# Altium schematic sheet CANTRICK MCU.SchDoc
size A4; SheetNumber: 4; SheetTotal: 5
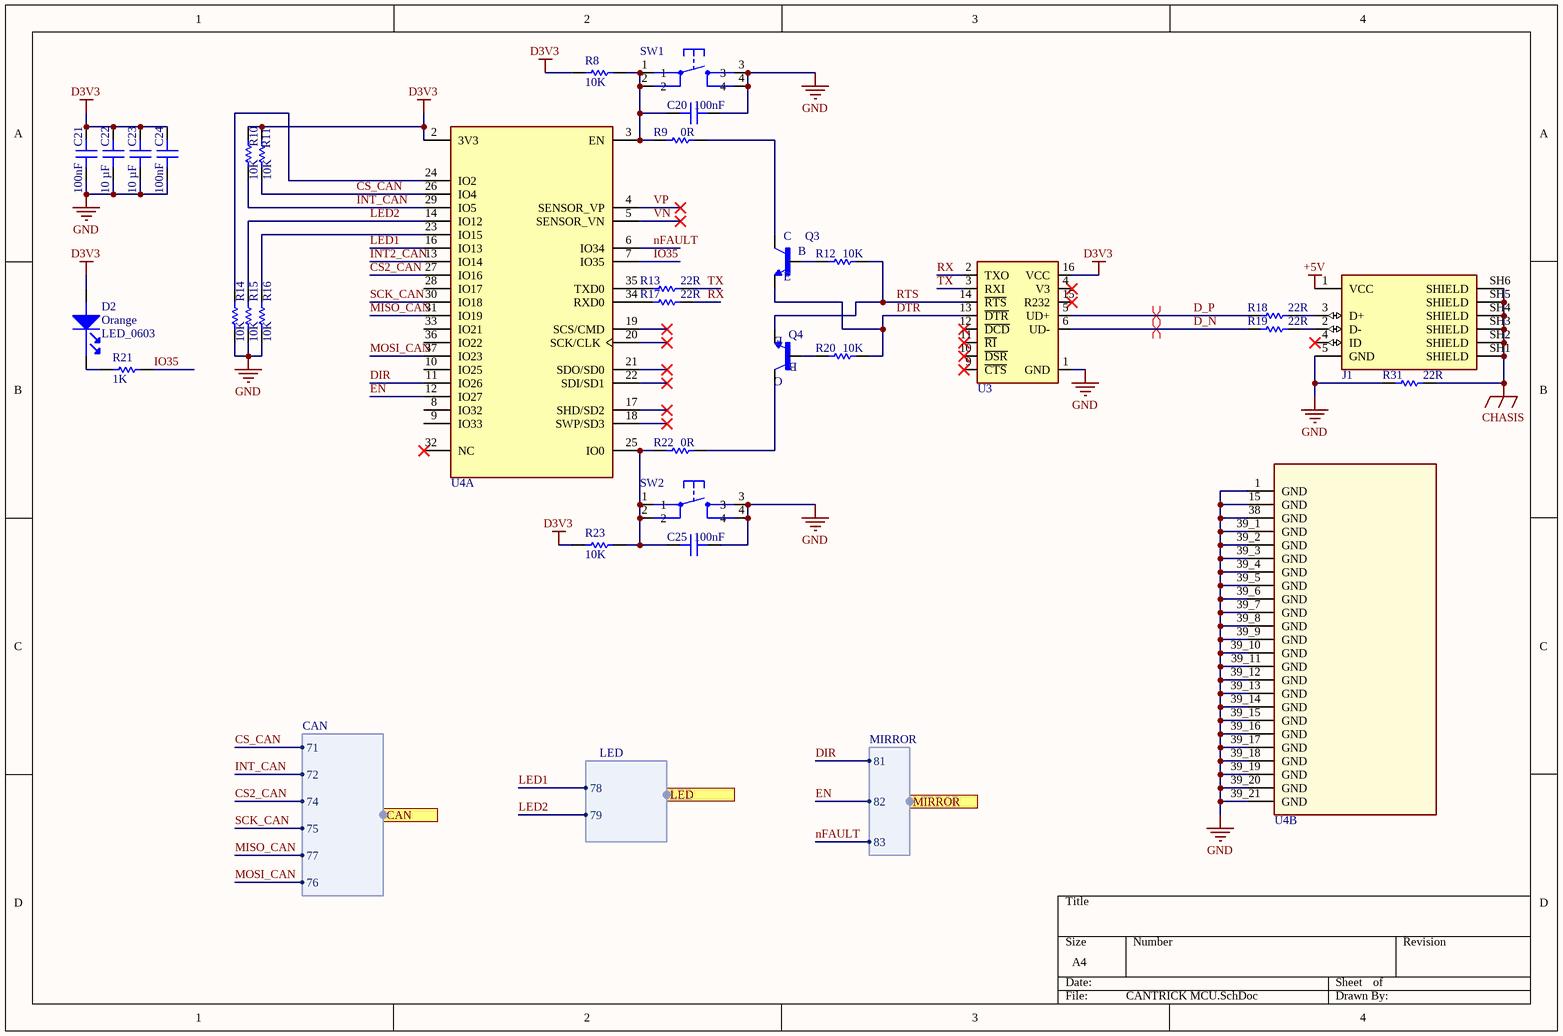
[diagram p0: CANTRICK MCU.SchDoc]

## Parts
C20  100nF  [CAP 0603]
C21  100nF  [CAP 0603]
C22  10 µF  [CAP 0603]
C23  10 µF  [CAP 0603]
C24  100nF  [CAP 0603]
C25  100nF  [CAP 0603]
D2  Orange  Package / Case: LED_0603  [LED]
J1  MICRO B  [MICRO USB B]  (value not drawn)
Q3  NMOS  [SOT23-3]  (value not drawn)
Q4  NMOS  [SOT23-3]  (value not drawn)
R8  10K  [Res 0603]
R9  0R  [Res 0603]
R10  10K  [Res 0603]
R11  10K  [Res 0603]
R12  10K  [Res 0603]
R13  22R  [Res 0603]
R14  10K  [Res 0603]
R15  10K  [Res 0603]
R16  10K  [Res 0603]
R17  22R  [Res 0603]
R18  22R  [Res 0603]
R19  22R  [Res 0603]
R20  10K  [Res 0603]
R21  1K  [Res 0603]
R22  0R  [Res 0603]
R23  10K  [Res 0603]
R31  22R  [Res 0603]
SW1  SW2  [SWITCH]  (value not drawn)
SW2  SW2  [SWITCH]  (value not drawn)
U3  CH340C  [CH340C]  (value not drawn)
U4  ESP32-WROOM-32UE-N8  [ESP32S]  (value not drawn)  (parts A,B of 2)

## Ports
CAN (harness CAN), LED (harness LED), MIRROR (harness MIRROR)

## Harnesses
CAN: 71, 72, 74, 75, 76, 77
LED: 78, 79
MIRROR: 81, 82, 83

## Nets
+5V: J1.1(VCC)
CHASIS: J1.SH1(SHIELD) J1.SH2(SHIELD) J1.SH3(SHIELD) J1.SH4(SHIELD) J1.SH5(SHIELD) J1.SH6(SHIELD) R31.2
D3V3: C21.2 C22.2 C23.2 C24.2 D2.1(ANODE) R8.1 R10.2 R11.2 R23.1 U3.16(VCC) U4.2(3V3)
GND: C20.1 C21.1 C22.1 C23.1 C24.1 C25.1 J1.5(GND) R14.1 R15.1 R16.1 R31.1 SW1.3 SW1.4 SW2.3 SW2.4 U3.1(GND) U4.1(GND) U4.15(GND) U4.38(GND) U4.39_1(GND) U4.39_2(GND) U4.39_3(GND) U4.39_4(GND) U4.39_5(GND) U4.39_6(GND) U4.39_7(GND) U4.39_8(GND) U4.39_9(GND) U4.39_10(GND) U4.39_11(GND) U4.39_12(GND) U4.39_13(GND) U4.39_14(GND) U4.39_15(GND) U4.39_16(GND) U4.39_17(GND) U4.39_18(GND) U4.39_19(GND) U4.39_20(GND) U4.39_21(GND)
CS2_CAN: U4.27(IO16) ; port CAN.74
CS_CAN: R11.1 U4.26(IO4) ; port CAN.71
D_N: R19.1 U3.6(UD-)
D_P: R18.1 U3.5(UD+)
DIR: U4.11(IO26) ; port MIRROR.81
DTR: Q3.2(E) R20.2 U3.13(~{DTR})
EN: U4.12(IO27) ; port MIRROR.82
INT2_CAN: U4.13(IO14)
INT_CAN: R10.1 U4.29(IO5) ; port CAN.72
IO35: R21.2 U4.7(IO35)
LED1: U4.16(IO13) ; port LED.78
LED2: R15.2 U4.14(IO12) ; port LED.79
MISO_CAN: U4.31(IO19) ; port CAN.77
MOSI_CAN: U4.37(IO23) ; port CAN.76
nFAULT: U4.6(IO34) ; port MIRROR.83
RTS: Q4.2(E) R12.2 U3.14(~{RTS})
RX: R17.2 U3.2(TXO)
SCK_CAN: U4.30(IO18) ; port CAN.75
TX: R13.2 U3.3(RXI)
VN: U4.5(SENSOR_VN)
VP: U4.4(SENSOR_VP)
NetC20_2: C20.2 R8.2 R9.1 SW1.1 SW1.2 U4.3(EN)
NetC25_2: C25.2 R22.1 R23.2 SW2.1 SW2.2 U4.25(IO0)
NetD2_2: D2.2(cathode) R21.1
NetJ1_2: J1.2(D-) R19.2
NetJ1_3: J1.3(D+) R18.2
NetQ3_1: Q3.1(B) R12.1
NetQ3_3: Q3.3(C) R9.2
NetQ4_1: Q4.1(B) R20.1
NetQ4_3: Q4.3(C) R22.2
NetR13_1: R13.1 U4.35(TXD0)
NetR14_2: R14.2 U4.24(IO2)
NetR16_2: R16.2 U4.23(IO15)
NetR17_1: R17.1 U4.34(RXD0)

Not connected (* = marked no-connect by the designer): J1 4(ID)*; U3 4(V3)* 9(~{CTS})* 10(~{DSR})* 11(~{RI})* 12(~{DCD})* 15(R232)*; U4 8(IO32) 9(IO33) 10(IO25) 17(SHD/SD2)* 18(SWP/SD3)* 19(SCS/CMD)* 20(SCK/CLK)* 21(SDO/SD0)* 22(SDI/SD1)* 28(IO17) 32(NC)* 33(IO21) 36(IO22)

## Layout directives
differential pair: D_N, D_P

## Library data of the parts
C20 C21 C24 C25 = GMC10X7R106K10NT: CAP0603 X7R 10UF 10% 10V; manufacturer: Cal-Chip Electronics, Inc.; Capacitance: 10 µF; Part Number: GMC10X7R106K10NT; Value: 100nF; Applications: General Purpose; componentlink1description: Datasheet; componentlink1url: https://88ce57.p3cdn1.secureserver.net/wp-content/uploads/2023/01/gmc_series-2.pdf; componentlink2description: DigiKey Link; componentlink2url: https://www.digikey.com/en/products/detail/cal-chip-electronics-inc/GMC10X7R106K10NT/18151126; Device Package: 0603 (1608 Metric); lastupdated: 2/9/2024 8:09:39 PM; Lifecycle Status: Active; Minimum Order: 1; Mounting Type: Surface Mount, MLCC; Operating Temperature: -55°C ~ 125°C; Package / Case: 0603 (1608 Metric); packaging: TapeAndReel; partid: 49835; Part Status: Active; price: 0.26; series: GMC; Size / Dimension: 0.063" L x 0.031" W (1.60mm x 0.80mm); Supplier 1: DigiKey; Supplier Part Number 1: 4713-GMC10X7R106K10NTCT-ND; Temperature Coefficient: X7R; Thickness (Max): 0.039" (1.00mm); Tolerance: ±10%; Voltage - Rated: 10V
C22 C23 = GMC10X7R106K10NT: CAP0603 X7R 10UF 10% 10V; manufacturer: Cal-Chip Electronics, Inc.; Part Number: GMC10X7R106K10NT; Value: 10 µF; Applications: General Purpose; Capacitance: 10 µF; componentlink1description: Datasheet; componentlink1url: https://88ce57.p3cdn1.secureserver.net/wp-content/uploads/2023/01/gmc_series-2.pdf; componentlink2description: DigiKey Link; componentlink2url: https://www.digikey.com/en/products/detail/cal-chip-electronics-inc/GMC10X7R106K10NT/18151126; Device Package: 0603 (1608 Metric); lastupdated: 2/9/2024 8:09:39 PM; Lifecycle Status: Active; Minimum Order: 1; Mounting Type: Surface Mount, MLCC; Operating Temperature: -55°C ~ 125°C; Package / Case: 0603 (1608 Metric); packaging: TapeAndReel; partid: 49835; Part Status: Active; price: 0.26; series: GMC; Size / Dimension: 0.063" L x 0.031" W (1.60mm x 0.80mm); Supplier 1: DigiKey; Supplier Part Number 1: 4713-GMC10X7R106K10NTCT-ND; Temperature Coefficient: X7R; Thickness (Max): 0.039" (1.00mm); Tolerance: ±10%; Voltage - Rated: 10V
D2 = LED ORANGE 606NM 0603: LED SMARTLED ORANGE 606NM 0603; Manufacturer: OSRAM Opto Semiconductors Inc; Manufacturer Part Number: LO L29K-H2K1-24-Z; Millicandela Rating: 6.3mcd; Voltage - Forward (Vf) Typ: 1.8V; Current - Test: 2mA; Wavelength - Peak: 610nm; Viewing Angle: 160°; Lens Type: Diffused; Lens Style/Size: Rectangle with Flat Top, 1.3mm x 0.8mm; Luminous Flux @ Current - Test: 25 mlm; By: Hieu.Nguyen_20191030; Supplier 1: Digi-Key; Supplier Part Number 1: 475-2740-1-ND; RoHS: RoHS Compliant; Category: Optoelectronics; Stock 1: 15900; Pricing 1: 1=0.17, 10=0.141, 100=0.1127, 250=0.0986, 500=0.09016 (USD); Color: Orange; Wavelength - Dominant: 606nm; Size / Dimension: 1.70mm L x 0.80mm W; Height: 0.65mm; Mounting Type: Surface Mount; Packaging: Cut Tape (CT); ComponentLink1URL: http://catalog.osram-os.com/catalogue/catalogue.do;jsessionid=302CF83AF637AE24E40AEB0ADA267EDD?act=downloadFile&favOid=020000010003f9de000100b6; ComponentLink1Description: http://catalog.osram-os.com/catalogue/catalogue.do;jsessionid=302CF83AF637AE24E40AEB0ADA267EDD?act=downloadFile&favOid=020000010003f9de000100b6
J1 = MICRO USB B
Q3 Q4 = MMBT3904: MMBT3904 Series 40 V CE Breakdown 0.2 A NPN General Purpose Amplifier - SOT-23; Manufacturer: onsemi; Collector Emitter Voltage (VCEO): 40V; hFE Min: 100; Max Power Dissipation: 350mW; Max Collector Current: 200mA; Transition Frequency: 300MHz; Collector Base Voltage (VCBO): 60V; Emitter Base Voltage (VEBO): 6V; Collector Emitter Saturation Voltage: 300mV; Supplier 1: Farnell; Manufacturer Part Number: MMBT3904; RoHS: Yes; Category: BJTs; Pricing 1: 5=0,136, 25=0,133, 100=0,0476, 250=0,0435, 500=0,043, 1000=0,022, 5000=0,02 (GBP); Mount: Surface Mount; Case/Package: SOT-23; Number of Pins: 3; Weight: 0.03g; Min Operating Temperature: -55°C; Max Operating Temperature: 150°C; Packaging: Tape and Reel; Polarity: NPN; Collector Emitter Breakdown Voltage: 40V; Voltage Rating (DC): 40V; Package Quantity: 1; Max Breakdown Voltage: 40V; Current Rating: 200mA; Series: -; Collector-emitter Voltage-Max: 300mV; Termination: SMD/SMT; Radiation Hardening: No; RoHS Compliant: Yes; Reach SVHC Compliant: No; Lead Free: Lead Free; Supplier Part Number 1: 9846727
R8-R23 R31 = Resistor 2.2K: Res Thick Film 0603 2.2K Ohm 5% 1/10W ±200ppm/°C Molded SMD SMD Paper T/R; Manufacturer: Vishay; Manufacturer Part Number: CRCW06032K20JNEA; Resistance: 2.2kR; Power Rating: 100mW; Voltage Rating: 75V; Supplier 1: Arrow Electronics; RoHS: Yes; Category: Chip SMD Resistors; Stock 1: 130000; Pricing 1: 5000=0.0053 (USD); Case/Package: 0603; Weight: 7.1E-05oz; Case Code (Metric): 1608; Case Code (Imperial): 0603; Contact Plating: Tin; Size Code: 0603; Min Operating Temperature: -55°C; Max Operating Temperature: 155°C; Package Quantity: 5000; Tolerance: 5%; Packaging: Tape and Reel; Resistor Type: Thick Film; Number of Terminations: 2; Temperature Coefficient: 200ppm/°C; Termination: SMD/SMT; Max Power Dissipation: 100mW; Features: Automotive AEC-Q200; Series: CRCW; Resistance Tolerance: 5%; Construction: Rectangular; Length: 1.55mm; Width: 0.85mm; Height: 0.45mm; Depth: 0.85mm; Ratings: AEC-Q200; Radiation Hardening: No; Military Standard: Not; RoHS Compliant: Yes; Reach SVHC Compliant: Unknown; Lead Free: 5697LeadFree; ComponentLink1URL: https://datasheet.ciiva.com/2462/dcrcwe3-2462048.pdf?src-supplier=Digikey; ComponentLink1Description: https://datasheet.ciiva.com/2462/dcrcwe3-2462048.pdf?src-supplier=Digikey; ComponentLink2URL: https://datasheet.ciiva.com/16767/70201119-16767464.pdf?src-supplier=Allied+Electronics; ComponentLink2Description: https://datasheet.ciiva.com/16767/70201119-16767464.pdf?src-supplier=Allied+Electronics; ComponentLink3URL: https://datasheet.ciiva.com/2462/dcrcwe3-2462046.pdf?src-supplier=Digikey; ComponentLink3Description: https://datasheet.ciiva.com/2462/dcrcwe3-2462046.pdf?src-supplier=Digikey; ComponentLink4URL: https://datasheet.ciiva.com/5541/dcrcwe3-109170-5541959.pdf?src-supplier=Mouser; ComponentLink4Description: https://datasheet.ciiva.com/5541/dcrcwe3-109170-5541959.pdf?src-supplier=Mouser; ComponentLink5URL: https://datasheet.ciiva.com/16286/dcrcwe3-16286997.pdf?src-supplier=Future+Electronics; ComponentLink5Description: https://datasheet.ciiva.com/16286/dcrcwe3-16286997.pdf?src-supplier=Future+Electronics; Supplier Part Number 1: CRCW06032K20JNEA
SW1 SW2 = SW2: Switch button 4 pin
U4 = ESP32-WROOM-32UE-N8: Multiprotocol Modules SMD module ESP32-WROOM-32UE, ESP32-D0WD-V3, ESP32 ECO V3,; Manufacturer: Espressif Systems; Supplier 1: Digikey; Manufacturer Part Number: ESP32-WROOM-32UE-N8; RoHS: No; Category: LDO; Stock 1: 3266; Pricing 1: 1=5,28, 10=4,566, 25=4,3196, 100=3,9802, 250=3,7768 (USD); ComponentLink1URL: https://datasheet.octopart.com/ESP32-WROOM-32UE-N8-Espressif-Systems-datasheet-188867343.pdf?src-supplier=TME; ComponentLink1Description: https://datasheet.octopart.com/ESP32-WROOM-32UE-N8-Espressif-Systems-datasheet-188867343.pdf?src-supplier=TME; Supplier Part Number 1: 1965-ESP32-WROOM-32UE-N8CT-ND